# EAGLE design adapterplatine (EAGLE 6.3)
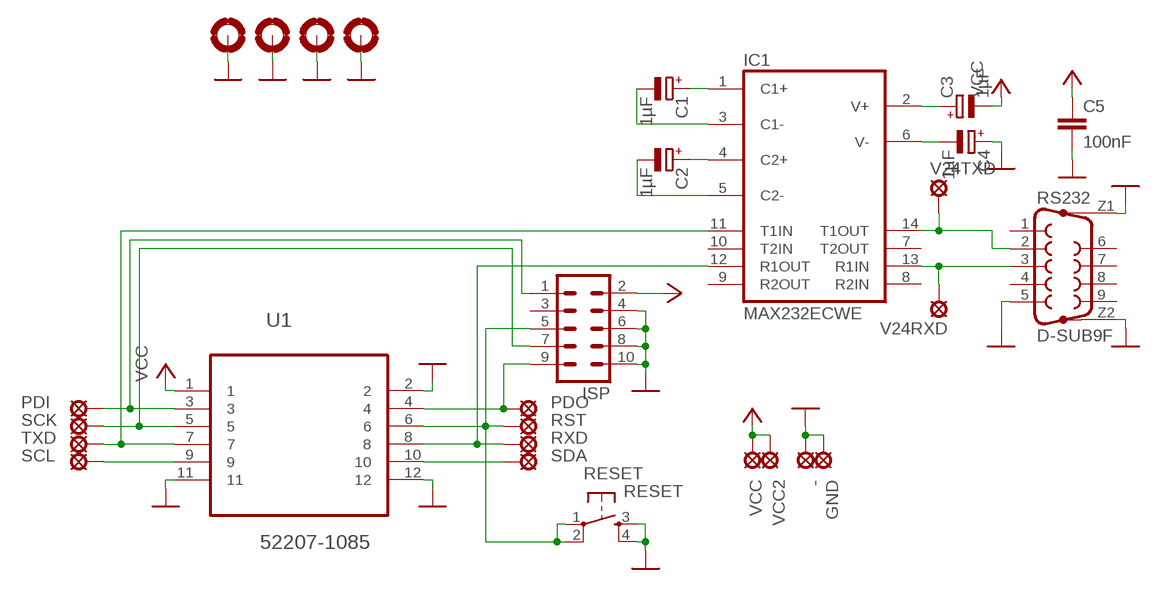
[diagram p0: schematic, sheet 1]

## Parts
-  SE11  [SE11]
C1  1µF  CPOL-EUCT3216  [CT3216]
C2  1µF  CPOL-EUCT3216  [CT3216]
C3  1µF  CPOL-EUCT3216  [CT3216]
C4  1µF  CPOL-EUCT3216  [CT3216]
C5  100nF  C-EUC1206  [C1206]
GND  SE11  [SE11]
IC1  MAX232ECWE  [SO16L]
ISP  ML10  [ML10]
PDI  SE11  [SE11]
PDO  SE11  [SE11]
RESET  RESET  TASTER  [TASTER]
RS232  D-SUB9F  [D-SUB9F]
RST  SE11  [SE11]
RXD  SE11  [SE11]
SCK  SE11  [SE11]
SCL  SE11  [SE11]
SDA  SE11  [SE11]
TXD  SE11  [SE11]
U1  52207-1085  [MOLEX_52207-1085]
U$1  LOCH  [LOCH]
U$2  LOCH  [LOCH]
U$3  LOCH  [LOCH]
U$4  LOCH  [LOCH]
V24RXD  SE11  [SE11]
V24TXD  SE11  [SE11]
VCC  SE11  [SE11]
VCC2  SE11  [SE11]

## Nets
GND: -.MP C4.+ C5.2 GND.MP ISP.4 ISP.6 ISP.8 ISP.10 RESET.3 RESET.4 RS232.5 RS232.Z1(G1) RS232.Z2(G2) U1.2 U1.11 U1.12 U$1.B3,0(MOUNT) U$2.B3,0(MOUNT) U$3.B3,0(MOUNT) U$4.B3,0(MOUNT)
N$1: IC1.14(T1OUT) RS232.2 V24TXD.MP
N$2: IC1.13(R1IN) RS232.3 V24RXD.MP
N$3: C1.+ IC1.1(C1+)
N$4: C1.- IC1.3(C1-)
N$5: C2.+ IC1.4(C2+)
N$6: C2.- IC1.5(C2-)
N$7: C4.- IC1.6(V-)
N$8: C3.+ IC1.2(V+)
N$9: IC1.11(T1IN) TXD.MP U1.7
N$10: IC1.12(R1OUT) RXD.MP U1.8
N$11: ISP.1 PDI.MP U1.3
N$12: ISP.5 RESET.1 RESET.2 RST.MP U1.6
N$13: ISP.7 SCK.MP U1.5
N$14: ISP.9 PDO.MP U1.4
N$15: SCL.MP U1.9
N$16: SDA.MP U1.10
VCC: C3.- C5.1 ISP.2 U1.1 VCC2.MP VCC.MP
Unconnected: IC1.7(T2OUT) IC1.8(R2IN) IC1.9(R2OUT) IC1.10(T2IN) ISP.3 RS232.1 RS232.4 RS232.6 RS232.7 RS232.8 RS232.9

## Power pins joined to a net without a drawn wire
GND: IC1.15(GND)
VCC: IC1.16(VCC)

## Library data of the parts
- GND PDI PDO RST RXD SCK SCL SDA TXD V24RXD V24TXD VCC VCC2 = solpad:SE11: SOLDER PAD RTM, drill 1,1mm, distributor Buerklin, 07F810
C1-C4 = rcl:CPOL-EU: POLARIZED CAPACITOR, European symbol
C5 = rcl:C-EU: CAPACITOR, European symbol
IC1 = maxim:MAX232ECWE: RS232 TRANSEIVER; MF: MAXIM; MPN: MAX232ECWE+; OC_FARNELL: 9724435; OC_NEWARK: 67K4440
ISP = con-ml:ML10: HARTING; OC_FARNELL: unknown; OC_NEWARK: unknown
RESET = president_george:TASTER
RS232 = president_george:D-SUB9F
U1 = Molex_By_element14_Batch_1:52207-1085: SOCKET FPC, SMT, 1MM, 10 WAY; MPN: 52207-1085; OC_FARNELL: 1079938; OC_NEWARK: 58J9503; PACKAGE: SOCKET FPC, SMT, 1MM, 10 WAY; SUPPLIER: Molex
U$1-U$4 = president_george:LOCH

## Net classes
0 default: width 0.5 mm

## Board
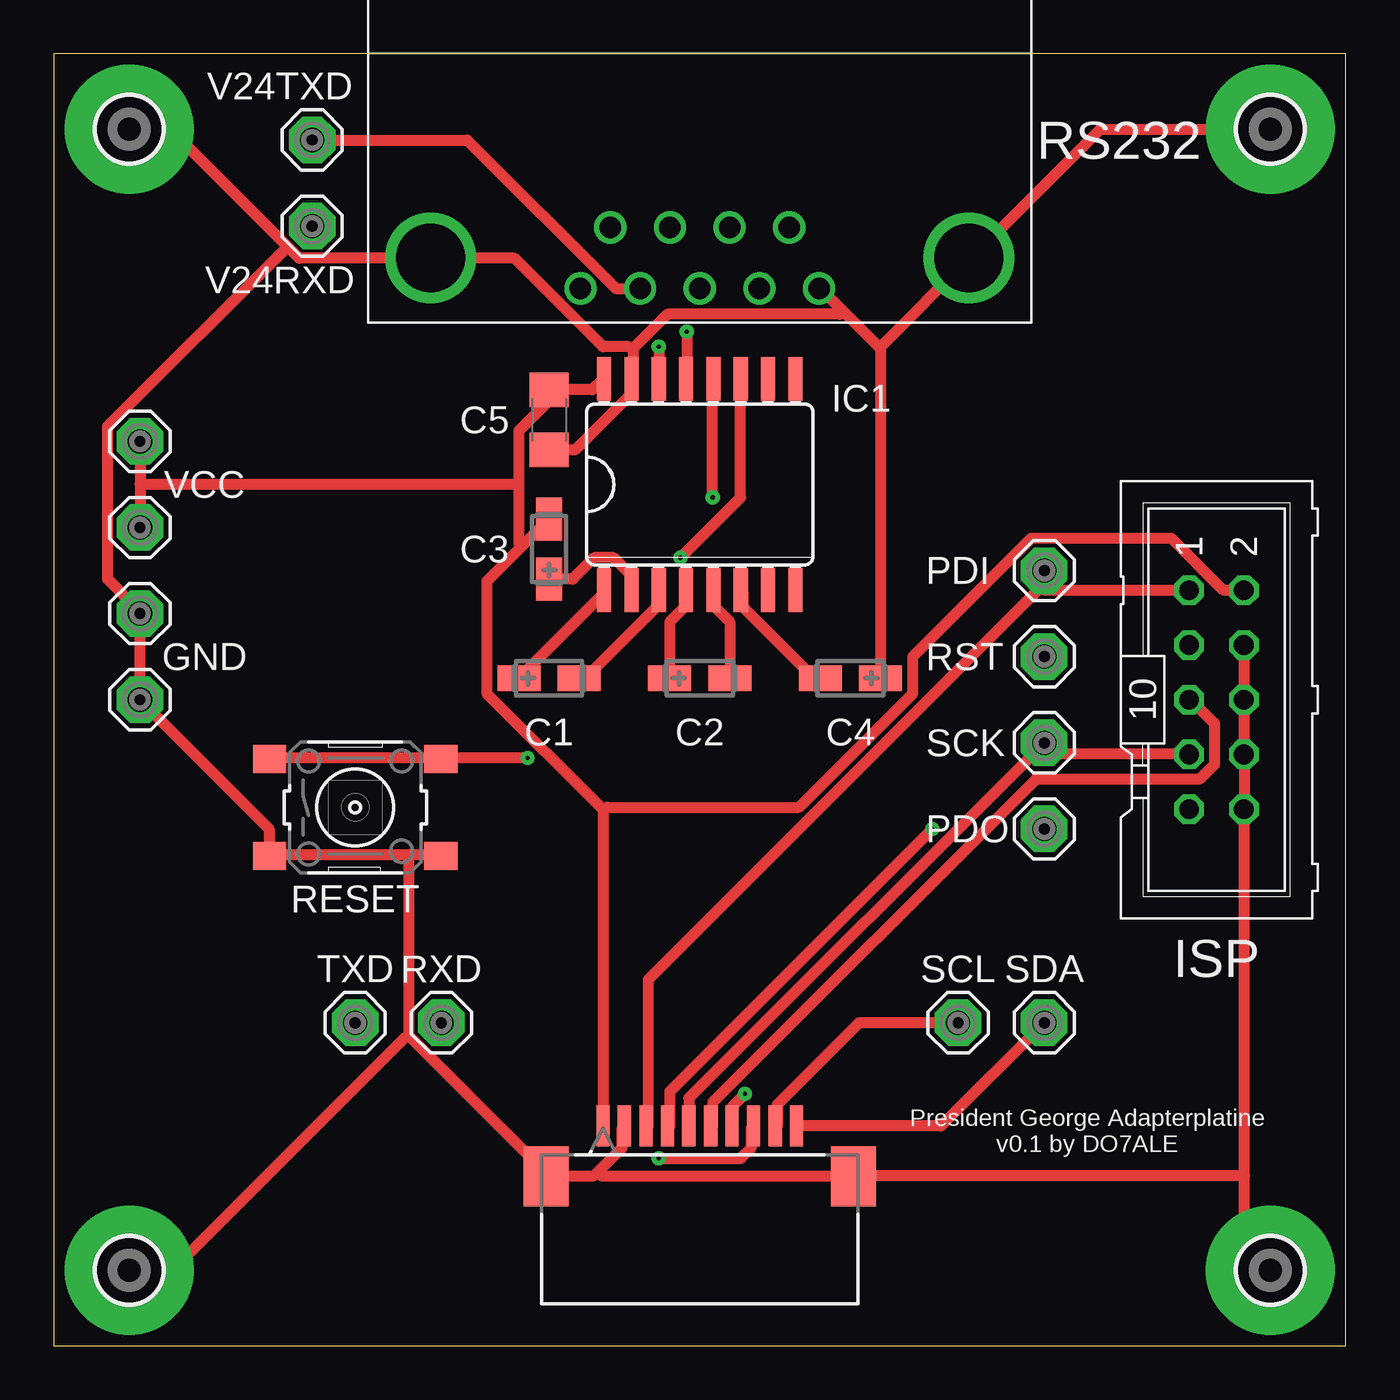
[diagram p1: board, top side]
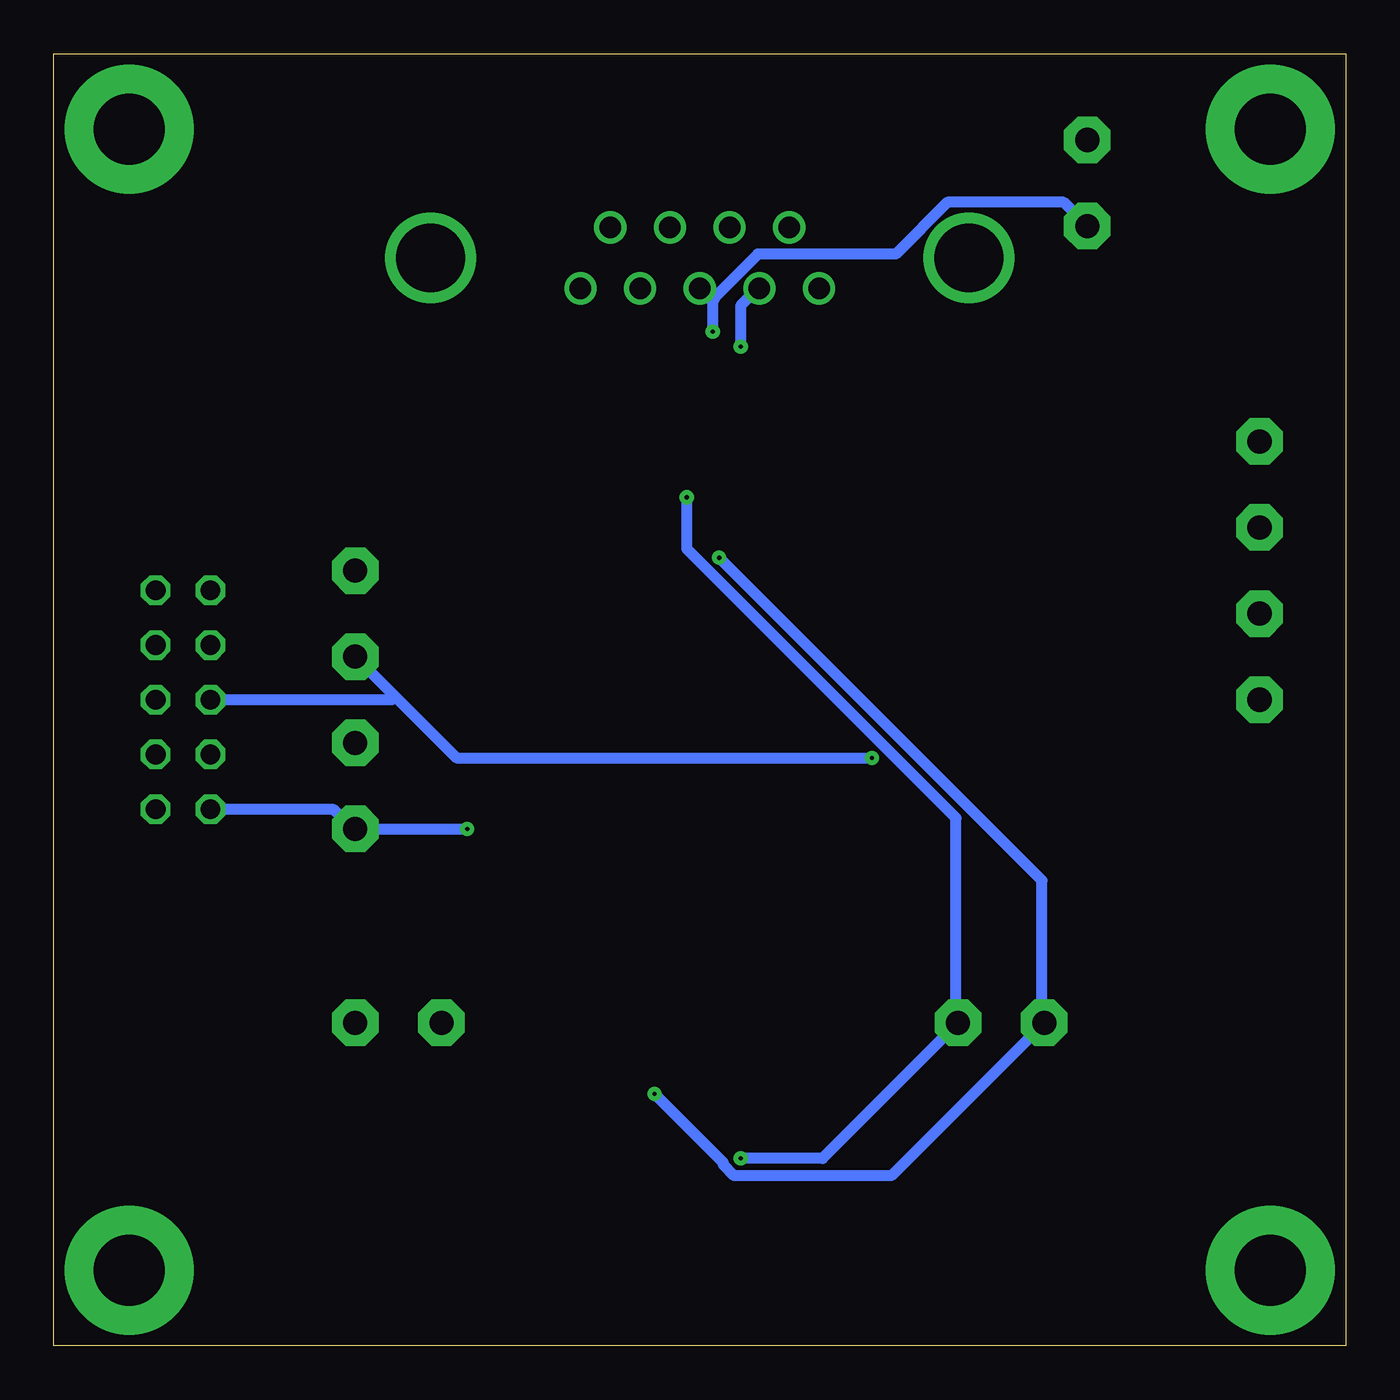
[diagram p2: board, bottom side, seen from below]

Size 60 x 60 mm. Coordinates in mm from the lower left corner, seen from the top.
Outline: 0,0 60,0 60,60 0,60 0,0
Copper layers (1*2+3*4+5*6+7*16): Top 0.035mm / dielectric 0.2mm / Route2 0.035mm / dielectric 0.15mm / Route3 0.035mm / dielectric 0.2mm / Route4 0.035mm / dielectric 0.15mm / Route5 0.035mm / dielectric 0.2mm / Route6 0.035mm / dielectric 0.15mm / Route7 0.035mm / dielectric 0.2mm / Bottom 0.035mm
Design rules "Eagle_WEdirekt_150_check": minimum track width 6mil, minimum drill 0.2mm, track to track 6mil, track to pad 6mil, pad to pad 8mil, via to via 6mil, smd to smd 8mil, copper to edge 12mil, drill to drill 24mil, minimum pad ring 9mil, minimum via ring 9mil, stop-mask expansion 3mil, vias tented up to drill 0mil, thermal gap 12mil

### Footprints (pad centres in the part's own frame; a part is rotated, then mirrored left to right if it is on the bottom)
SE11 = drill 1.118 pad 2.159 octagon: MP 0,0
CT3216 = smd 2 x 1.2: + -1.4,0; - 1.4,0
C1206 = smd 1.6 x 1.8: 1 -1.4,0; 2 1.4,0
SO16L = smd 0.66 x 2.032: 1 -4.445,-4.902; 2 -3.175,-4.902; 3 -1.905,-4.902; 4 -0.635,-4.902; 5 0.635,-4.902; 6 1.905,-4.902; 7 3.175,-4.902; 8 4.445,-4.902; 9 4.445,4.902; 10 3.175,4.902; 11 1.905,4.902; 12 0.635,4.902; 13 -0.635,4.902; 14 -1.905,4.902; 15 -3.175,4.902; 16 -4.445,4.902
ML10 = drill 0.914 octagon: 1 -5.08,-1.27; 2 -5.08,1.27; 3 -2.54,-1.27; 4 -2.54,1.27; 5 0,-1.27; 6 0,1.27; 7 2.54,-1.27; 8 2.54,1.27; 9 5.08,-1.27; 10 5.08,1.27
TASTER = smd 1.55 x 1.3: 1 -3.975,2.25; 2 3.975,2.25; 3 -3.975,-2.25; 4 3.975,-2.25
D-SUB9F = drill 1: 1 5.54,6.5; 2 2.77,6.5; 3 0,6.5; 4 -2.77,6.5; 5 -5.54,6.5; 6 4.155,3.66; 7 1.385,3.66; 8 -1.385,3.66; 9 -4.155,3.66 | drill 3.2: Z1 -12.5,5.08; Z2 12.5,5.08
MOLEX_52207-1085 = smd 0.61 x 1.905: 1 4.496,4.801; 2 3.505,4.801; 3 2.489,4.801; 4 1.499,4.801; 5 0.508,4.801; 6 -0.508,4.801; 7 -1.499,4.801; 8 -2.489,4.801; 9 -3.505,4.801; 10 -4.496,4.801 | smd 2.108 x 2.794: 11 -7.137,7.137; 12 7.137,7.137
LOCH = drill 3.3 pad 6: B3,0 0,0

### Placement (x,y rotation side)
-  4,30 0 top
C1  23,31 0 top
C2  30,31 0 top
C3  23,37 90 top
C4  37,31 180 top
C5  23,43 270 top
GND  4,34 0 top
IC1  30,40 0 top
ISP  54,30 270 top
PDI  46,36 0 top
PDO  46,24 0 top
RESET  14,25 0 top
RS232  30,55.6 180 top
RST  46,32 0 top
RXD  18,15 0 top
SCK  46,28 0 top
SCL  42,15 0 top
SDA  46,15 0 top
TXD  14,15 0 top
U1  30,15 180 top
U$1  3.5,56.5 0 top
U$2  56.5,3.5 0 top
U$3  56.5,56.5 0 top
U$4  3.5,3.5 0 top
V24RXD  12,52 0 top
V24TXD  12,56 0 top
VCC  4,42 0 top
VCC2  4,38 0 top

### Tracks (layer width: path | path; a pad name or v marks a point on that pad's centre or on a via)
GND
  Top 0.5: C5.2 24.2,41.6 26.8,44.2 26.8,44.9 IC1.15 26.9,45.1 26.9,46.3 | 38.4,46.3 C4.+ | 36.65,48.05 35.6,49.1 RS232.5 | 36.65,48.05 38.4,46.3 | 26.9,46.3 28.5,47.9 36.5,47.9 36.65,48.05 | 26.9,46.3 26.7,46.4 25.5,46.4 21.4,50.5 17.5,50.5 RS232.Z2 17.3,50.5 11.4,50.5 10.85,51.05 | 38.4,46.3 38.5,46.5 42.5,50.5 RS232.Z1 42.7,50.6 48.6,56.5 U$3.B3,0 | U$1.B3,0 5.4,56.5 10.85,51.05 | 16.5,22.8 17.9,22.8 RESET.4 | 16.5,22.8 10.1,22.8 RESET.3 10,23 10,24 -.MP GND.MP 3.9,34.2 2.5,35.6 2.5,42.7 10.85,51.05 | 25.25,8.05 25.1,7.9 22.9,7.9 U1.12 22.8,8.1 16.5,14.4 | 25.25,8.05 26.4,9.2 26.4,10.1 U1.2 | 25.25,8.05 25.4,7.9 37.1,7.9 U1.11 37.3,7.9 55.3,7.9 | ISP.4 55.3,32.5 55.3,30.2 ISP.6 55.3,30 55.3,27.7 ISP.8 55.3,27.4 55.3,25 ISP.10 55.3,24.7 55.3,7.9 | 55.3,7.9 55.3,4.7 U$2.B3,0 | 16.5,14.4 16.5,22.8 | U$4.B3,0 5.5,3.5 16.3,14.3 16.5,14.4
N$1  (via drill 0.2)
  Top 0.5: v28.1,46.4 28.1,45 IC1.14 | RS232.2 26.1,49.1 19.2,56 V24TXD.MP
  Bottom 0.5: v28.1,46.4 28.1,48.3 27.3,49.1 RS232.2
N$2  (via drill 0.2)
  Top 0.5: v29.4,47.1 29.4,45 IC1.13
  Bottom 0.5: 29.4,48.5 v29.4,47.1 | RS232.3 29.4,48.5 | V24RXD.MP 13.1,53.1 18.5,53.1 20.9,50.7 27.3,50.7 29.3,48.7 29.4,48.5
N$3
  Top 0.5: C1.+ 25.6,35 IC1.1
N$4
  Top 0.5: C1.- 24.7,31 28,34.3 28,35 IC1.3
N$5
  Top 0.5: C2.+ 28.6,33.6 29.3,34.3 29.3,35 IC1.4
N$6
  Top 0.5: C2.- 31.4,33.6 30.7,34.3 30.7,35 IC1.5
N$7
  Top 0.5: C4.- 35.3,31 32,34.3 32,35 IC1.6
N$8
  Top 0.5: C3.+ 24.1,35.6 25.1,36.6 26,36.6 26.8,35.8 26.8,35.1 IC1.2
N$9  (via drill 0.2)
  Top 0.5: v32.1,11.7 31.5,11.1 U1.7 | v29.1,36.6 31.9,39.4 IC1.11
  Bottom 0.5: v32.1,11.7 28.9,8.5 28.9,8.4 28.4,7.9 21.1,7.9 TXD.MP 14.1,15.2 14.1,21.6 v29.1,36.6
N$10  (via drill 0.2)
  Top 0.5: v28.1,8.7 31.9,8.7 32.4,9.2 32.4,10.1 U1.8 | v30.6,39.4 30.6,44.9 IC1.12
  Bottom 0.5: v28.1,8.7 24.3,8.7 RXD.MP 18.1,15.2 18.1,24.5 30.6,37 v30.6,39.4
N$11
  Top 0.5: U1.3 27.6,10.2 27.6,17 46,35.4 PDI.MP 46,35.1 52.7,35.1 ISP.1
N$12  (via drill 0.2)
  Top 0.5: U1.6 30.6,10.2 30.6,11.3 45.6,26.3 53.2,26.3 53.9,27 53.9,28.9 52.8,30 ISP.5 | RESET.1 10.1,27.3 17.9,27.3 RESET.2 18.2,27.3 v22,27.3
  Bottom 0.5: v22,27.3 41.3,27.3 44.15,30.15 | RST.MP 44.15,30.15 | ISP.5 44.3,30 44.15,30.15
N$13
  Top 0.5: U1.5 29.5,11.5 SCK.MP 45.8,27.5 52.7,27.5 ISP.7
N$14  (via drill 0.2)
  Top 0.5: v40.8,24 28.6,11.8 28.6,10.2 U1.4
  Bottom 0.5: v40.8,24 PDO.MP 46.2,24.1 47,24.9 52.7,24.9 ISP.9
N$15
  Top 0.5: SCL.MP 37.4,15 33.6,11.2 33.6,10.2 U1.9
N$16
  Top 0.5: SDA.MP 41.2,10.2 U1.10
VCC
  Top 0.5: VCC.MP 4,40 | 4,40 VCC2.MP | IC1.16 25.5,44.9 25,44.4 C5.1 22.9,44.2 22.9,43.8 21.6,42.5 21.6,40 | 25.5,24.9 U1.1 | 25.5,24.9 20.1,30.3 20.1,35.5 21.75,37.15 | C3.- 21.75,37.15 | ISP.2 55.2,35.1 54.3,35.1 51.9,37.5 45.4,37.5 39.9,32 39.9,30.3 34.6,25 25.7,25 25.5,24.9 | 21.6,40 21.6,37.3 21.75,37.15 | 21.6,40 4,40

### Text on the board
tNames: President George Adapterplatine / v0.1 by DO7ALE